# Altium schematic sheet sdram-16-bit.SchDoc
size A
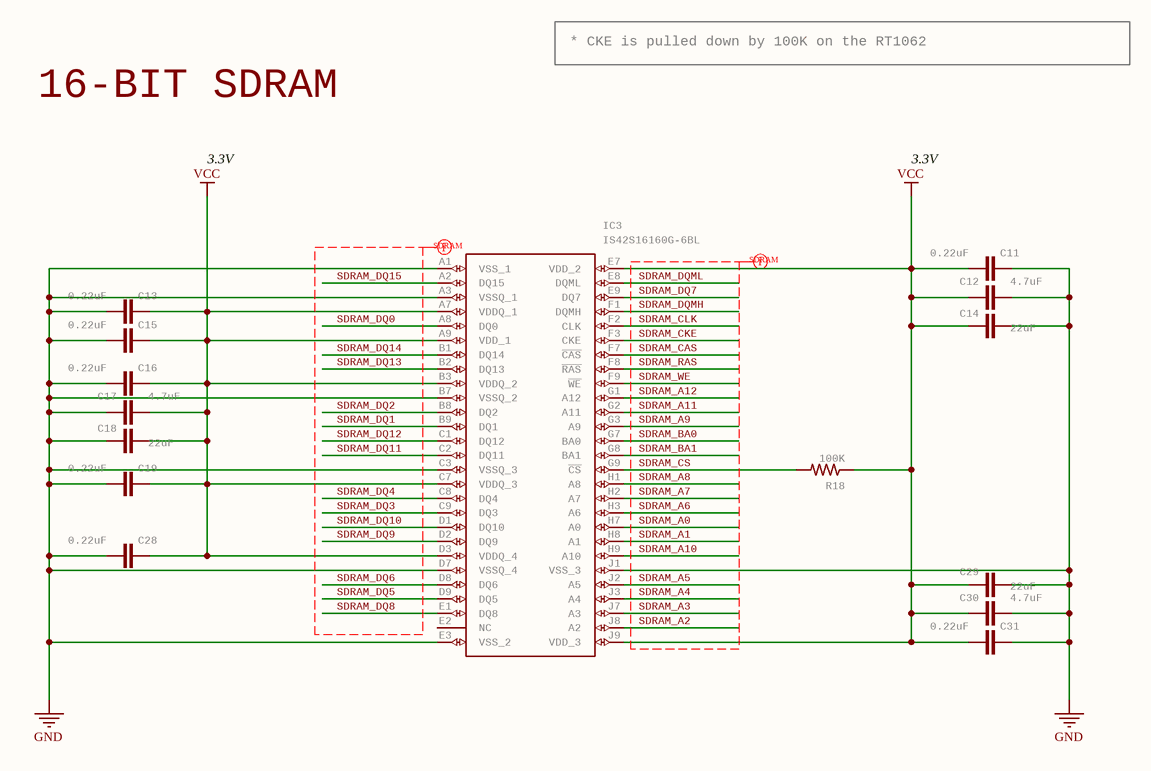
[diagram p0: sdram-16-bit.SchDoc]

## Parts
C11  0.22uF  [C0201]
C12  4.7uF  [0402-CAP]
C13  0.22uF  [C0201]
C14  22uF  [0805]
C15  0.22uF  [C0201]
C16  0.22uF  [C0201]
C17  4.7uF  [0402-CAP]
C18  22uF  [0805]
C19  0.22uF  [C0201]
C28  0.22uF  [C0201]
C29  22uF  [0805]
C30  4.7uF  [0402-CAP]
C31  0.22uF  [C0201]
IC3  IS42S16160G-6BL  [BGA54C80P9X9_800X800X120]
R18  100K  [0402-RES]

## Nets
GND: C11.1 C12.2 C13.2 C14.2 C15.2 C16.2 C17.1 C18.1 C19.2 C28.2 C29.2 C30.2 C31.1 IC3.A1(VSS_1) IC3.A3(VSSQ_1) IC3.B7(VSSQ_2) IC3.C3(VSSQ_3) IC3.D7(VSSQ_4) IC3.E3(VSS_2) IC3.J1(VSS_3)
VCC: C11.2 C12.1 C13.1 C14.1 C15.1 C16.1 C17.2 C18.2 C19.1 C28.1 C29.1 C30.1 C31.2 IC3.A7(VDDQ_1) IC3.A9(VDD_1) IC3.B3(VDDQ_2) IC3.C7(VDDQ_3) IC3.D3(VDDQ_4) IC3.E7(VDD_2) IC3.J9(VDD_3) R18.1
SDRAM_A0: IC3.H7(A0)
SDRAM_A1: IC3.H8(A1)
SDRAM_A2: IC3.J8(A2)
SDRAM_A3: IC3.J7(A3)
SDRAM_A4: IC3.J3(A4)
SDRAM_A5: IC3.J2(A5)
SDRAM_A6: IC3.H3(A6)
SDRAM_A7: IC3.H2(A7)
SDRAM_A8: IC3.H1(A8)
SDRAM_A9: IC3.G3(A9)
SDRAM_A10: IC3.H9(A10)
SDRAM_A11: IC3.G2(A11)
SDRAM_A12: IC3.G1(A12)
SDRAM_BA0: IC3.G7(BA0)
SDRAM_BA1: IC3.G8(BA1)
SDRAM_CAS: IC3.F7(~{CAS})
SDRAM_CKE: IC3.F3(CKE)
SDRAM_CLK: IC3.F2(CLK)
SDRAM_CS: IC3.G9(~{CS}) R18.2
SDRAM_DQ0: IC3.A8(DQ0)
SDRAM_DQ1: IC3.B9(DQ1)
SDRAM_DQ2: IC3.B8(DQ2)
SDRAM_DQ3: IC3.C9(DQ3)
SDRAM_DQ4: IC3.C8(DQ4)
SDRAM_DQ5: IC3.D9(DQ5)
SDRAM_DQ6: IC3.D8(DQ6)
SDRAM_DQ7: IC3.E9(DQ7)
SDRAM_DQ8: IC3.E1(DQ8)
SDRAM_DQ9: IC3.D2(DQ9)
SDRAM_DQ10: IC3.D1(DQ10)
SDRAM_DQ11: IC3.C2(DQ11)
SDRAM_DQ12: IC3.C1(DQ12)
SDRAM_DQ13: IC3.B2(DQ13)
SDRAM_DQ14: IC3.B1(DQ14)
SDRAM_DQ15: IC3.A2(DQ15)
SDRAM_DQMH: IC3.F1(DQMH)
SDRAM_DQML: IC3.E8(DQML)
SDRAM_RAS: IC3.F8(~{RAS})
SDRAM_WE: IC3.F9(~{WE})

Not connected (* = marked no-connect by the designer): IC3 E2(NC)

## Layout directives
net class SDRAM: SDRAM_A0, SDRAM_A1, SDRAM_A2, SDRAM_A3, SDRAM_A4, SDRAM_A5, SDRAM_A6, SDRAM_A7, SDRAM_A8, SDRAM_A9, SDRAM_A10, SDRAM_A11, SDRAM_A12, SDRAM_BA0, SDRAM_BA1, SDRAM_CAS, SDRAM_CKE, SDRAM_CLK, SDRAM_CS, SDRAM_DQ0, SDRAM_DQ1, SDRAM_DQ2, SDRAM_DQ3, SDRAM_DQ4, SDRAM_DQ5, SDRAM_DQ6, SDRAM_DQ7, SDRAM_DQ8, SDRAM_DQ9, SDRAM_DQ10, SDRAM_DQ11, SDRAM_DQ12, SDRAM_DQ13, SDRAM_DQ14, SDRAM_DQ15, SDRAM_DQMH, SDRAM_DQML, SDRAM_RAS, SDRAM_WE

## Notes on the sheet
- * CKE is pulled down by 100K on the RT1062
- 16-BIT SDRAM
- 3.3V

## Library data of the parts
C11 C13 C15 C16 C19 C28 C31 = C-EUC0201: CAPACITOR, European symbol; MPN: GRM033R60J224ME15D; GateName_1: G$1; SymbolName_1: C-EU; POPULARITY: 0; DeviceName: C0201; LibraryName: rcl; DeviceSetName: C-EU; SPICEPREFIX: C; Part Number: GRM033R60J224ME15D
C12 C17 C30 = CAP0402-CAP: CapacitorStandard 0603 ceramic capacitor, and 0.1" leaded capacitor.; MPN: JMK105BBJ475MV-F; GateName_1: G$1; SymbolName_1: CAP; DeviceName: 0402-CAP; LibraryName: sfe; DeviceSetName: CAP; Part Number: JMK105BBJ475MV-F
C14 C18 C29 = 22UF-0805-6.3V-20%: 22ÂµF ceramic capacitors    A capacitor is a passive two-terminal electrical component used to store electrical energy temporarily in an electric field.; MPN: CL21A226MQQNNNE; GateName_1: G$1; SymbolName_1: CAP; PROD_ID: CAP-08402; DeviceName: -0805-6.3V-20%; LibraryName: SparkFun-Capacitors; DeviceSetName: 22UF; Part Number: CL21A226MQQNNNE
IC3 = IS42S16160G-6BL: DRAM 256M 16Mx16 166Mhz SDR SDRAM, 3.3V   Source:  Datasheet; MANUFACTURER_NAME: Integrated Silicon Solution Inc.; GateName_1: G$1; SymbolName_1: IS42S16160G-6BL; LibraryName: IS42S16160G-6BL; DeviceSetName: IS42S16160G-6BL; HEIGHT: 1.2mm; MANUFACTURER_PART_NUMBER: IS42S16160G-6BL; MOUSER_PART_NUMBER: 870-IS42S16160G-6BL; MOUSER_PRICE-STOCK: https://www.mouser.co.uk/ProductDetail/ISSI/IS42S16160G-6BL?qs=9hm%252BDT1Jr7yvZBhvmJyecQ%3D%3D; MPN: IS42S16160G-6BL; Part Number: IS42S16160G-6BL
R18 = RESISTOR0402-RES: ResistorBasic schematic elements and footprints for 0603, 1206, and PTH resistors.; MPN: AC0402FR-07100KL; GateName_1: G$1; SymbolName_1: RESISTOR; DeviceName: 0402-RES; LibraryName: sfe; DeviceSetName: RESISTOR; Part Number: AC0402FR-07100KL